# EAGLE schematic hw_interface_board (EAGLE 8.5.0)
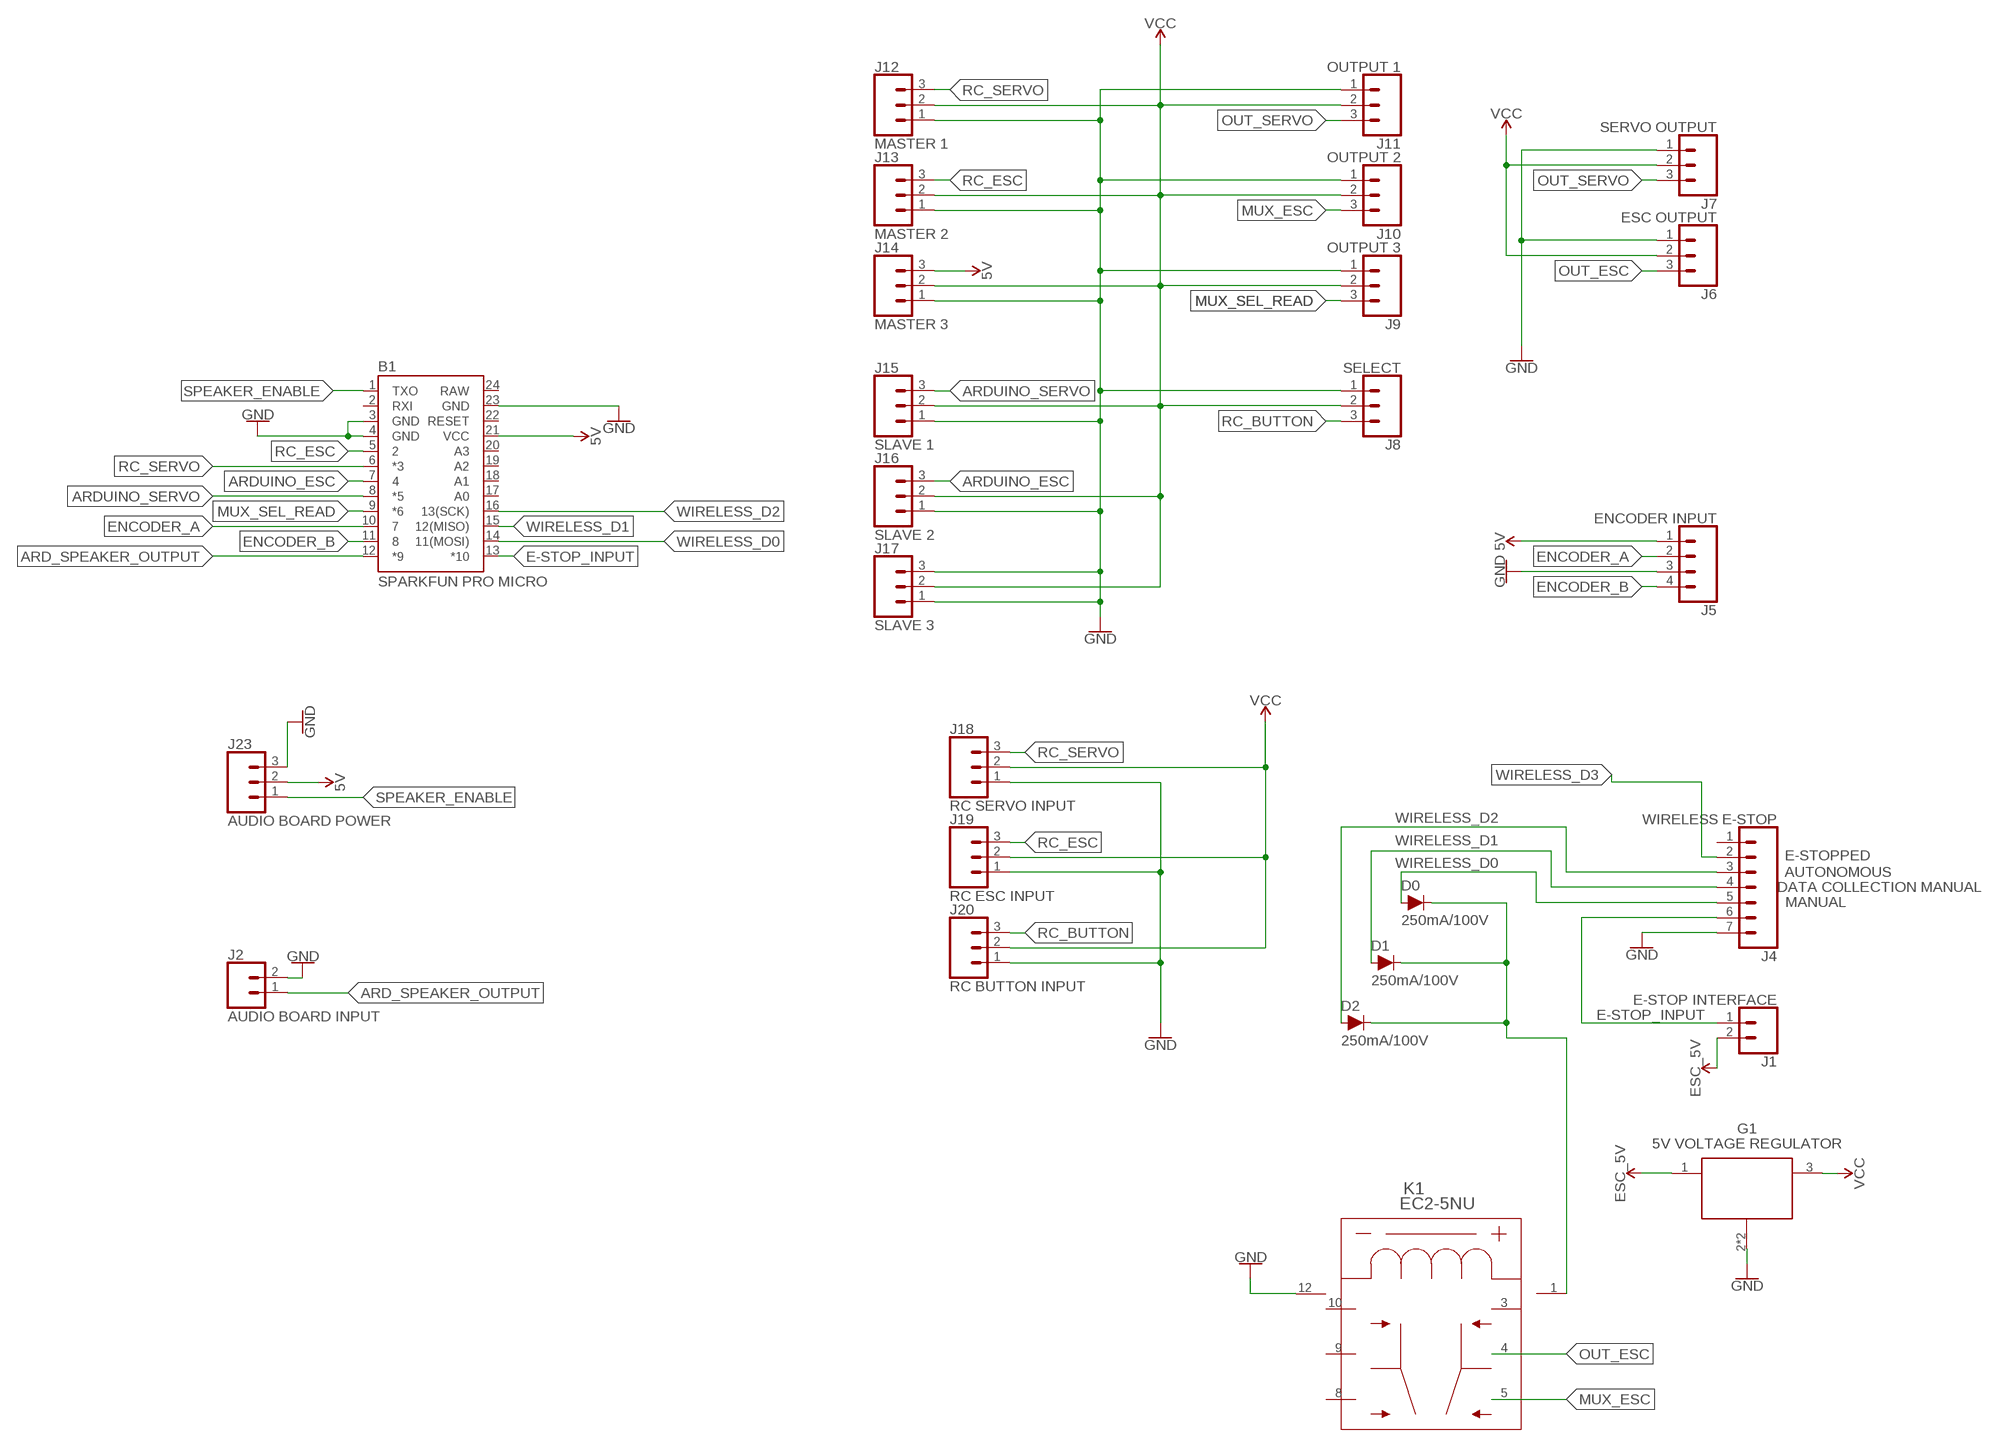
[diagram p0: schematic, sheet 1]

## Parts
B1  SPARKFUN PRO MICRO  SPARKFUN_PRO_MICRO  [SPARKFUN_PRO_MICRO]
D0  250mA/100V  DIODE-BAS16J  [SOD-323]
D1  250mA/100V  DIODE-BAS16J  [SOD-323]
D2  250mA/100V  DIODE-BAS16J  [SOD-323]
G1  5V VOLTAGE REGULATOR  VOLTAGE_REG  [SOT89]
J1  E-STOP INTERFACE  CONN_02  [1X02]
J2  AUDIO BOARD INPUT  CONN_02  [1X02]
J4  WIRELESS E-STOP  CONN_07  [1X07]
J5  ENCODER INPUT  CONN_04  [1X04]
J6  ESC OUTPUT  CONN_03  [1X03]
J7  SERVO OUTPUT  CONN_03  [1X03]
J8  SELECT  CONN_03  [1X03]
J9  OUTPUT 3  CONN_03  [1X03]
J10  OUTPUT 2  CONN_03  [1X03]
J11  OUTPUT 1  CONN_03  [1X03]
J12  MASTER 1  CONN_03  [1X03]
J13  MASTER 2  CONN_03  [1X03]
J14  MASTER 3  CONN_03  [1X03]
J15  SLAVE 1  CONN_03  [1X03]
J16  SLAVE 2  CONN_03  [1X03]
J17  SLAVE 3  CONN_03  [1X03]
J18  RC SERVO INPUT  CONN_03  [1X03]
J19  RC ESC INPUT  CONN_03  [1X03]
J20  RC BUTTON INPUT  CONN_03  [1X03]
J23  AUDIO BOARD POWER  CONN_03  [1X03]
K1  EC2-5NU  [EC2NU]

## Nets
5V: B1.21(VCC) J5.1 J14.3 J23.2
ARD_SPEAKER_OUTPUT: B1.12(*9) J2.1
ARDUINO_ESC: B1.7 J16.3
ARDUINO_SERVO: B1.8(*5) J15.3
E-STOP_INPUT: B1.13(*10) J1.1 J4.6
ENCODER_A: B1.10 J5.2
ENCODER_B: B1.11 J5.4
ESC_5V: D0.C D1.C D2.C G1.1(OUTPUT) J1.2 K1.1
GND: B1.3(GND) B1.4(GND) B1.23(GND) G1.2(GND) G1.2@1(GND) J2.2 J4.7 J5.3 J6.1 J7.1 J8.1 J9.1 J10.1 J11.1 J12.1 J13.1 J14.1 J15.1 J16.1 J17.1 J17.3 J18.1 J19.1 J20.1 J23.3 K1.12
MUX_ESC: J10.3 K1.5
MUX_SEL_READ: B1.9(*6) J9.3
OUT_ESC: J6.3 K1.4
OUT_SERVO: J7.3 J11.3
RC_BUTTON: J8.3 J20.3
RC_ESC: B1.5 J13.3 J19.3
RC_SERVO: B1.6(*3) J12.3 J18.3
SPEAKER_ENABLE: B1.1(TXO) J23.1
VCC: G1.3(INPUT) J6.2 J7.2 J8.2 J9.2 J10.2 J11.2 J12.2 J13.2 J14.2 J15.2 J16.2 J17.2 J18.2 J19.2 J20.2
WIRELESS_D0: B1.14(11(MOSI)) D0.A J4.5
WIRELESS_D1: B1.15(12(MISO)) D1.A J4.4
WIRELESS_D2: B1.16(13(SCK)) D2.A J4.3
WIRELESS_D3: J4.2
Unconnected: B1.2(RXI) B1.17(A0) B1.18(A1) B1.19(A2) B1.20(A3) B1.22(RESET) J4.1 K1.3 K1.8 K1.9 K1.10

## Notes on the sheet
- E-STOPPED
- AUTONOMOUS
- DATA COLLECTION MANUAL
- MANUAL

## Power pins joined to a net without a drawn wire
RAW: B1.24(RAW)

## Library data of the parts
B1 = SparkFun-Boards:SPARKFUN_PRO_MICRO: SparkFun Pro Micro Atmega32U4 compatible footprint. SparkFun Products: 3.3V/8MHz <https://www.sparkfun.com/products/12587> 5V/16MHz <https://www.sparkfun.com/products/12640>
D0 D1 D2 = SparkFun-DiscreteSemi:DIODE: Diode These are standard reverse protection diodes and small signal diodes. SparkFun Products: SparkFun SparkPunk Sound Kit <https://www.sparkfun.com/products/11177> SparkFun ESP8266 Thing <https://www.sparkfun.com/products/13231>; PROD_ID: DIO-09646
G1 = hw_interface_board:VOLTAGE_REG
J1 J2 = SparkFun-Connectors:CONN_02: Multi connection point. Often used as Generic Header-pin footprint for 0.1 inch spaced/style header connections On any of the 0.1 inch spaced packages, you can populate with these: Break Away Headers - Straight <https://www.sparkfun.com/products/116> (PRT-00116) Break Away Male Headers - Right Angle <https://www.sparkfun.com/products/553> (PRT-00553) Female Headers <https://www.sparkfun.com/products/115> (PRT-00115) Break Away Headers - Machine Pin <https://www.sparkfun.com/products/117> (PRT-00117) Break Away Female Headers - Swiss Machine Pin <https://www.sparkfun.com/products/743> (PRT-00743) For SCREWTERMINALS and SPRING TERMINALS visit here: Screw Terimnals on SparkFun.com <https://www.sparkfun.com/search/results?term=Screw+Terminals> (5mm/3.5mm/2.54mm spacing) This device is also useful as a general connection point to wire up your design to another part of your project. Our various solder wires solder well into these plated through hole pads. Hook-Up Wire - Assortment (Stranded, 22 AWG) <https://www.sparkfun.com/products/11375> (PRT-11375) Hook-Up Wire - Assortment (Solid Core, 22 AWG) <https://www.sparkfun.com/products/11367> (PRT-11367) View the entire wire category on our website here <https://www.sparkfun.com/categories/141> Special notes: Molex polarized connector foot print use with: PRT-08233 with associated crimp pins and housings. 2.54_SCREWTERM for use with PRT-10571. 3.5mm Screw Terminal footprints for PRT-08084 5mm Screw Terminal footprints for use with PRT-08432
J4 = SparkFun-Connectors:CONN_07: Multi connection point. Often used as Generic Header-pin footprint for 0.1 inch spaced/style header connections On any of the 0.1 inch spaced packages, you can populate with these: Break Away Headers - Straight <https://www.sparkfun.com/products/116> (PRT-00116) Break Away Male Headers - Right Angle <https://www.sparkfun.com/products/553> (PRT-00553) Female Headers <https://www.sparkfun.com/products/115> (PRT-00115) Break Away Headers - Machine Pin <https://www.sparkfun.com/products/117> (PRT-00117) Break Away Female Headers - Swiss Machine Pin <https://www.sparkfun.com/products/743> (PRT-00743) For SCREWTERMINALS and SPRING TERMINALS visit here: Screw Terimnals on SparkFun.com <https://www.sparkfun.com/search/results?term=Screw+Terminals> (5mm/3.5mm/2.54mm spacing) This device is also useful as a general connection point to wire up your design to another part of your project. Our various solder wires solder well into these plated through hole pads. Hook-Up Wire - Assortment (Stranded, 22 AWG) <https://www.sparkfun.com/products/11375> (PRT-11375) Hook-Up Wire - Assortment (Solid Core, 22 AWG) <https://www.sparkfun.com/products/11367> (PRT-11367) View the entire wire category on our website here <https://www.sparkfun.com/categories/141> Special notes: Molex polarized connector foot print use with SKU : PRT-08231 with associated crimp pins and housings. 1MM SMD Version SKU: PRT-10208 NOTES ON THE VARIANTS LOCK and LOCK_LONGPADS... This footprint was designed to help hold the alignment of a through-hole component (i.e. 6-pin header) while soldering it into place. You may notice that each hole has been shifted either up or down by 0.005 of an inch from it's more standard position (which is a perfectly straight line). This slight alteration caused the pins (the squares in the middle) to touch the edges of the holes. Because they are alternating, it causes a "brace" to hold the component in place. 0.005 has proven to be the perfect amount of "off-center" position when using our standard breakaway headers. Although looks a little odd when you look at the bare footprint, once you have a header in there, the alteration is very hard to notice. Also,if you push a header all the way into place, it is covered up entirely on the bottom side.
J5 = SparkFun-Connectors:CONN_04: Multi connection point. Often used as Generic Header-pin footprint for 0.1 inch spaced/style header connections On any of the 0.1 inch spaced packages, you can populate with these: Break Away Headers - Straight <https://www.sparkfun.com/products/116> (PRT-00116) Break Away Male Headers - Right Angle <https://www.sparkfun.com/products/553> (PRT-00553) Female Headers <https://www.sparkfun.com/products/115> (PRT-00115) Break Away Headers - Machine Pin <https://www.sparkfun.com/products/117> (PRT-00117) Break Away Female Headers - Swiss Machine Pin <https://www.sparkfun.com/products/743> (PRT-00743) For SCREWTERMINALS and SPRING TERMINALS visit here: Screw Terimnals on SparkFun.com <https://www.sparkfun.com/search/results?term=Screw+Terminals> (5mm/3.5mm/2.54mm spacing) This device is also useful as a general connection point to wire up your design to another part of your project. Our various solder wires solder well into these plated through hole pads. Hook-Up Wire - Assortment (Stranded, 22 AWG) <https://www.sparkfun.com/products/11375> (PRT-11375) Hook-Up Wire - Assortment (Solid Core, 22 AWG) <https://www.sparkfun.com/products/11367> (PRT-11367) View the entire wire category on our website here <https://www.sparkfun.com/categories/141> Special notes: Molex polarized connector foot print use with SKU : PRT-08231 with associated crimp pins and housings. 1MM SMD Version SKU: PRT-10208; PROD_ID: CONN-09696
J6-J20 J23 = SparkFun-Connectors:CONN_03: Multi connection point. Often used as Generic Header-pin footprint for 0.1 inch spaced/style header connections On any of the 0.1 inch spaced packages, you can populate with these: Break Away Headers - Straight <https://www.sparkfun.com/products/116> (PRT-00116) Break Away Male Headers - Right Angle <https://www.sparkfun.com/products/553> (PRT-00553) Female Headers <https://www.sparkfun.com/products/115> (PRT-00115) Break Away Headers - Machine Pin <https://www.sparkfun.com/products/117> (PRT-00117) Break Away Female Headers - Swiss Machine Pin <https://www.sparkfun.com/products/743> (PRT-00743) Stackable Header - 3 Pin (Female, 0.1") <https://www.sparkfun.com/products/13875> (PRT-13875) For SCREWTERMINALS and SPRING TERMINALS visit here: Screw Terimnals on SparkFun.com <https://www.sparkfun.com/search/results?term=Screw+Terminals> (5mm/3.5mm/2.54mm spacing) This device is also useful as a general connection point to wire up your design to another part of your project. Our various solder wires solder well into these plated through hole pads. Hook-Up Wire - Assortment (Stranded, 22 AWG) <https://www.sparkfun.com/products/11375> (PRT-11375) Hook-Up Wire - Assortment (Solid Core, 22 AWG) <https://www.sparkfun.com/products/11367> (PRT-11367) View the entire wire category on our website here <https://www.sparkfun.com/categories/141> Special notes: Molex polarized connector foot print use with SKU : PRT-08232 with associated crimp pins and housings.; PROD_ID: XXX-00000; VALUE: 455-1750-1-ND
K1 = hw_interface_board:EC2-5NU; MANUFACTURER_PART_NUMBER: EC25NU; VENDOR: KEMET